# Altium schematic sheet PWR_CTRL.SchDoc: Power Control
size A4; Engineer: Rain Sarapuu; DocumentNumber: 6; Revision: 1; SheetNumber: 6; SheetTotal: 15
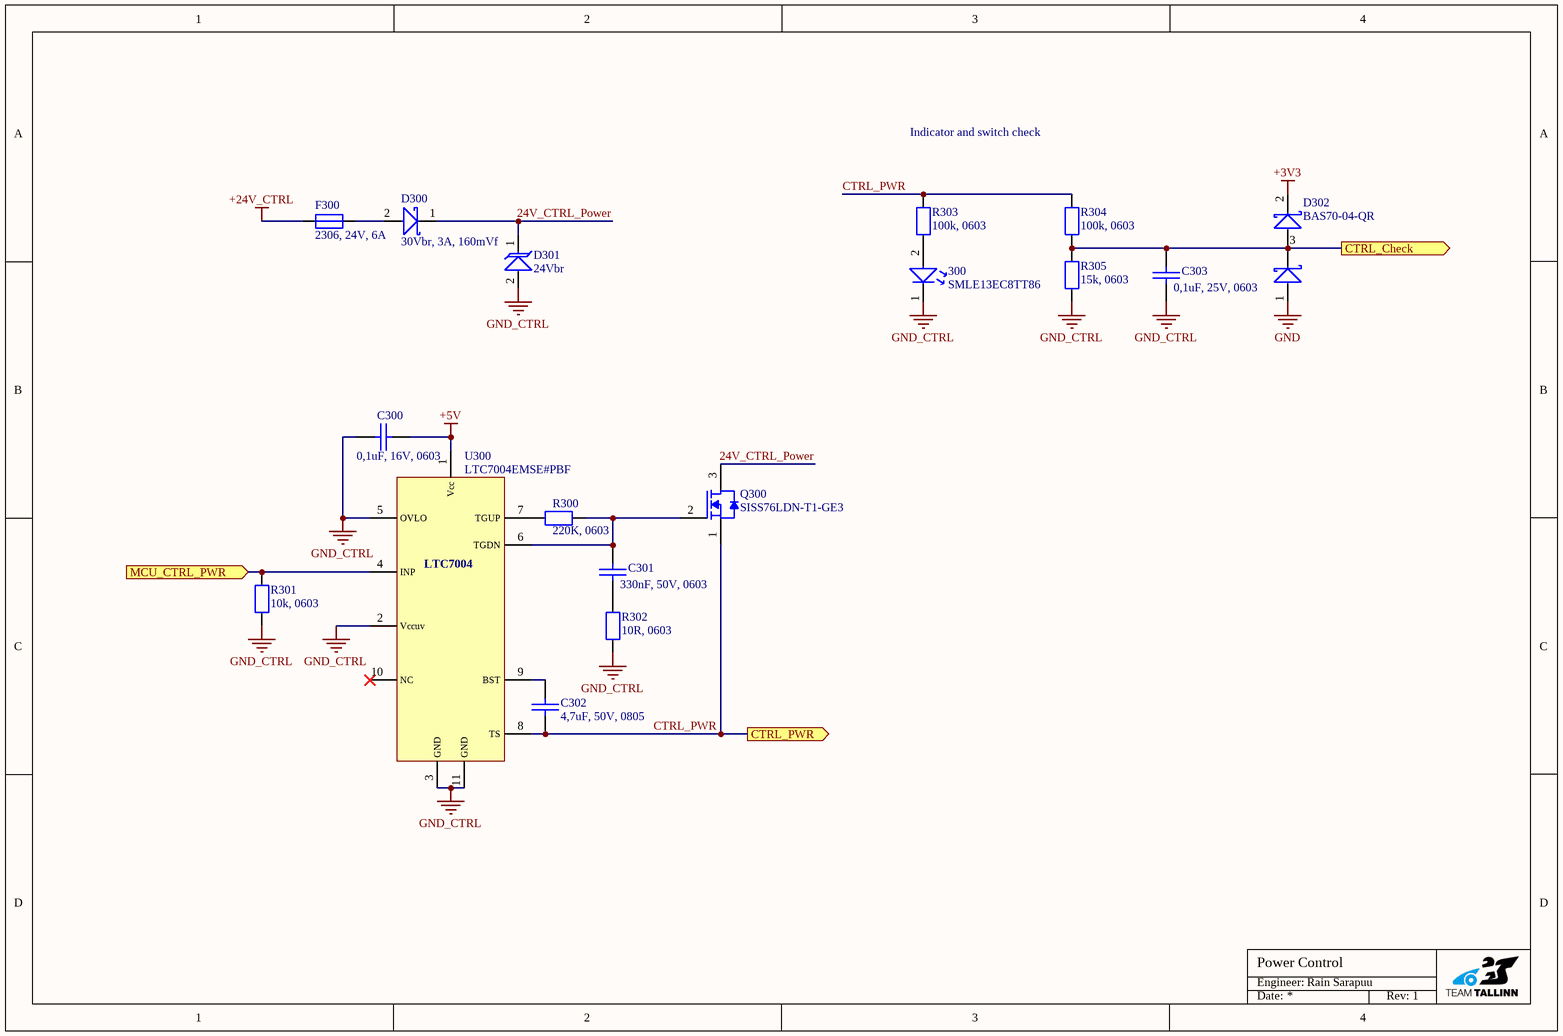
[diagram p0: PWR_CTRL.SchDoc]

## Parts
300  SMLE13EC8TT86  [LED [0603] 1608]
C300  0,1uF, 16V, 0603  [CAP [0603] 1608]
C301  330nF, 50V, 0603  [CAP [0603] 1608]
C302  4,7uF, 50V, 0805  [CAP [0805] 2012]
C303  0,1uF, 25V, 0603  [CAP [0603] 1608]
D300  30Vbr, 3A, 160mVf  [SOD-128]
D301  24Vbr  [SOD-128]
D302  BAS70-04-QR  [SOT23-3]
F300  2306, 24V, 6A  [FUSE [1206] 3216]
Q300  SISS76LDN-T1-GE3  [PowerPAK 1212-8S]
R300  220K, 0603  [RES [0603] 1608]
R301  10k, 0603  [RES [0603] 1608]
R302  10R, 0603  [RES [0603] 1608]
R303  100k, 0603  [RES [0603] 1608]
R304  100k, 0603  [RES [0603] 1608]
R305  15k, 0603  [RES [0603] 1608]
U300  LTC7004EMSE#PBF  [LTC7004EMSE#PBF-Footprint-1]

## Ports
CTRL_Check (out), CTRL_PWR (out), MCU_CTRL_PWR (in)

## Nets
+3V3: D302.2
+5V: C300.1 U300.1(Vcc)
+24V_CTRL: F300.2
GND: D302.1
GND_CTRL: 300.1 C300.2 C303.2 D301.2(A) R301.2 R302.1 R305.1 U300.2(Vccuv) U300.3(GND) U300.5(OVLO) U300.11(GND)
24V_CTRL_Power: D300.1(K) D301.1(K) Q300.3(D)
CTRL_Check: C303.1 D302.3 R304.1 R305.2 ; port CTRL_Check
CTRL_PWR: C302.2 Q300.1(S) R303.2 R304.2 U300.8(TS) ; port CTRL_PWR
MCU_CTRL_PWR: R301.1 U300.4(INP) ; port MCU_CTRL_PWR
Net300_2: 300.2 R303.1
NetC301_1: C301.1 Q300.2(G) R300.2 U300.6(TGDN)
NetC301_2: C301.2 R302.2
NetC302_1: C302.1 U300.9(BST)
NetD300_2: D300.2(A) F300.1
NetR300_1: R300.1 U300.7(TGUP)

Not connected (* = marked no-connect by the designer): U300 10(NC)*

## Notes on the sheet
- Indicator and switch check
- Engineer:
- Date:
- Rev:
- (in symbol CMP-019-00014-3) LTC7004

## Library data of the parts
300 = CMP-004-00006-2: Single Color LED, Green, Colorless Transparent, 1.2mm; Manufacturer Part Number: SMLE13EC8TT86; Supplier Part Number: 755-SMLE13EC8TT86; Supplier: Mouser
C300-C303 = CMP-001-00084-16: Default capacitor part; Supplier Part Number: *; Supplier: *; Manufacturer Part Number: *
D300 = CMP-004-00020-1: Rectifier Diode, Schottky, 1 Phase, 1 Element, 3A, 30V V(RRM), Silicon; Manufacturer Part Number: PMEG3030EP,115; Supplier: Mouser; Supplier Part Number: 771-PMEG3030EP115
D301 = CMP-004-00018-1: Trans Voltage Suppressor Diode, 600W, 24V V(RWM), Unidirectional, 1 Element, Silicon; Manufacturer Part Number: VS24VUA1LAMTFTR; Supplier Part Number: 2989546; Supplier: Farnell
D302 = CMP-004-00033-4: Diode Small Signal Schottky 70V 70mA 3-Pin SOT-23 T/R; Manufacturer: Nexperia; Supplier Part Number: 771-BAS70-04-QR; Manufacturer Part Number: BAS70-04-QR; Supplier: Mouser; Price: 0,242
F300 = CMP-005-00006-1: Electric Fuse, 6A, 24VDC, 80A (IR), Surface Mount, 1206; Manufacturer Part Number: SF-1206HIA600M-2; Supplier: Farnell; Supplier Part Number: 3361312
Q300 = CMP-013-00023-1: Power Field-Effect Transistor; Manufacturer: Vishay; Price: 1,02; Supplier: Mouser; Manufacturer Part Number: SISS76LDN-T1-GE3; Supplier Part Number: 78-SISS76LDN-T1-GE3
R300-R305 = CMP-009-00038-12: Standard resistor part; Supplier Part Number: *; Manufacturer Part Number: *; Supplier: *
U300 = CMP-019-00014-3: Buffer/Inverter Based MOSFET Driver, CMOS, PDSO10; Manufacturer Part Number: LTC7004EMSE#PBF; Supplier: Mouser; Supplier Part Number: 584-LTC7004EMSEPBF